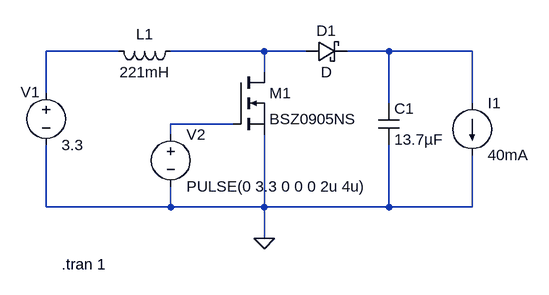
[diagram p0: schematic Boost-Converter-Alt.asc]
Boost-Converter-Alt.asc, the LTspice schematic file:
Version 4
SHEET 1 880 680
WIRE -64 80 -176 80
WIRE 160 80 16 80
WIRE 224 80 160 80
WIRE 352 80 288 80
WIRE 480 80 352 80
WIRE 160 112 160 80
WIRE -176 144 -176 80
WIRE 352 160 352 80
WIRE 480 160 480 80
WIRE 112 192 16 192
WIRE 16 208 16 192
WIRE -176 320 -176 224
WIRE 16 320 16 288
WIRE 16 320 -176 320
WIRE 160 320 160 208
WIRE 160 320 16 320
WIRE 352 320 352 224
WIRE 352 320 160 320
WIRE 480 320 480 240
WIRE 480 320 352 320
WIRE 160 368 160 320
FLAG 160 368 0
SYMBOL voltage -176 128 R0
WINDOW 0 -39 15 Left 2
WINDOW 123 0 0 Left 0
WINDOW 39 0 0 Left 0
SYMATTR InstName V1
SYMATTR Value 3.3
SYMBOL ind 32 64 R90
WINDOW 0 5 56 VBottom 2
WINDOW 3 32 56 VTop 2
SYMATTR InstName L1
SYMATTR Value 221mH
SYMBOL cap 336 160 R0
SYMATTR InstName C1
SYMATTR Value 13.7µF
SYMBOL voltage 16 192 R0
WINDOW 123 0 0 Left 0
WINDOW 39 0 0 Left 0
SYMATTR InstName V2
SYMATTR Value PULSE(0 3.3 0 0 0 2u 4u)
SYMBOL schottky 224 96 R270
WINDOW 0 32 32 VTop 2
WINDOW 3 0 32 VBottom 2
SYMATTR InstName D1
SYMBOL nmos 112 112 R0
SYMATTR InstName M1
SYMATTR Value BSZ0905NS
SYMBOL current 480 160 R0
WINDOW 123 0 0 Left 0
WINDOW 39 0 0 Left 0
SYMATTR InstName I1
SYMATTR Value 40mA
TEXT -152 408 Left 2 !.tran 1

The netlist it stands for:
* Boost-Converter-Alt.asc
V1 N001 0 3.3
L1 N002 N001 221mH
C1 N003 0 13.7µF
V2 N004 0 PULSE(0 3.3 0 0 0 2u 4u)
D1 N002 N003 D
M1 N002 N004 0 0 BSZ0905NS
I1 N003 0 40mA
.model D D
.lib standard.dio
.model NMOS NMOS
.model PMOS PMOS
.lib standard.mos
.tran 1
.backanno
.end